# Altium schematic sheet Power.SchDoc
size 292 x 193 mm; Author: Power Lin; DocumentNumber: 4; SheetNumber: 4; SheetTotal: 4; Website: wiki-power.com
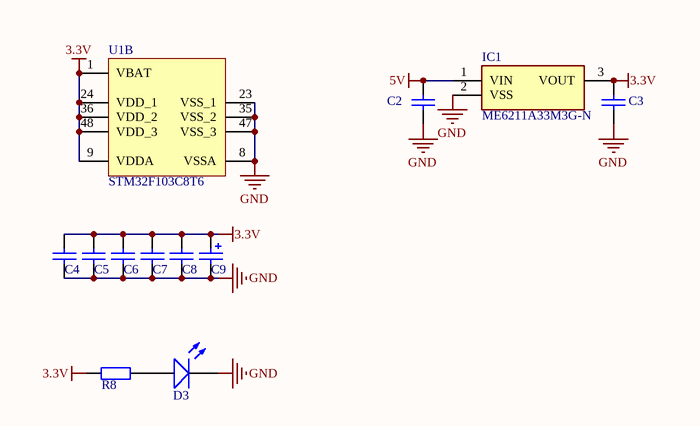
[diagram p0: Power.SchDoc]

## Parts
C2  1uF  [CAP-0603]  (value not drawn)
C3  1uF  [CAP-0603]  (value not drawn)
C4  100nF  [CAP-0603]  (value not drawn)
C5  100nF  [CAP-0603]  (value not drawn)
C6  100nF  [CAP-0603]  (value not drawn)
C7  100nF  [CAP-0603]  (value not drawn)
C8  100nF  [CAP-0603]  (value not drawn)
C9  10uF  [CASE-B_3528]  (value not drawn)
D3  RED  [LED-0603]  (value not drawn)
IC1  ME6211A33M3G-N  [SOT-23-3]
R8  10K  [R-0603]  (value not drawn)
U1  STM32F103C8T6  [LQFP_48]  (part B of 2)

## Nets
3.3V: C3.2 C4.2 C5.2 C6.2 C7.2 C8.2 C9.1 IC1.3(VOUT) R8.2 U1.1(VBAT) U1.9(VDDA) U1.24(VDD_1) U1.36(VDD_2) U1.48(VDD_3)
5V: C2.2 IC1.1(VIN)
GND: C2.1 C3.1 C4.1 C5.1 C6.1 C7.1 C8.1 C9.2 D3.K IC1.2(VSS) U1.8(VSSA) U1.23(VSS_1) U1.35(VSS_2) U1.47(VSS_3)
NetD3_A: D3.A R8.1

## Notes on the sheet
- Author
- DocumentName
- ModifiedDate
- ProjectName
- SheetNumber
- SheetTotal
- Website
- Revision

## Library data of the parts
C2-C8 = CAP: 贴片电容; ComponentLink1Description: 供应商链接; ComponentLink1URL: http://www.szlcsc.com/product/details_53938.html; Package: 0402; Supplier: LC; SuppliersPartNumber: C52923
C9 = CAP-POL: 贴片电容-有极性; ComponentLink1Description: 供应商链接; ComponentLink1URL: http://www.szlcsc.com/product/details_16815.html; Package: 3528; Supplier: LC; SuppliersPartNumber: C16133
D3 = LED: 发光二极管; pin to pad: A>1 K>2; ComponentLink1Description: 供应商链接; ComponentLink1URL: http://www.szlcsc.com/product/details_2663.html; Package: 0603; Supplier: LC; SuppliersPartNumber: C2290
IC1 = ME6211A33M3G-N: 线性稳压; Manufacturer_Name: Nexperia; Manufacturer_Part_Number: SI2302DS; Datasheet Link: https://assets.nexperia.com/documents/data-sheet/SI2302DS.pdf; Height: 1.1mm; Mouser Part Number: N/A; Mouser Price/Stock: https://www.mouser.com/Search/Refine.aspx?Keyword=N%2FA; RS Part Number: 7983053P; RS Price/Stock: http://uk.rs-online.com/web/p/products/7983053P
R8 = RES: 贴片电阻; Package: 0805; Supplier: LC; SuppliersPartNumber: C17798
U1 = STM32F103Cx: 单片机; PartNumber: STM32F100C8T6B; A/D Converter: 1x12-bit (10 Channel); Core: ARM Cortex-M3; D/A Converter: 2x12-bit (2 Channel); FLASH Size (Prog) (kB): 64; I/Os (High Current): 37; Internal RAM Size (kB): 8; Operating Frequency(F) (Processor speed) (MHz): 24; Packing: Tray; Supply Voltage(Vcc) min (V): 2; DatasheetVersion: Rev. 7; PackageVersion: Rev. 6, 06/2013; PackageReference: LQFP48; PackageDescription: 48-Pin Low Profile Quad Flat Package, 7 x 7 mm Body, 0.5 mm Pitch; Supplier 1: Digi-Key; Supplier Part Number 1: 497-10499-ND; Supplier 2: Farnell; Supplier Part Number 2: 1838511; Supplier 3: Newark; Supplier Part Number 3: 76R0988; Supplier 4: Mouser; Supplier Part Number 4: 511-STM32F100C8T6B; Mounting Technology: Surface Mount; ComponentLink1Description: Manufacturer URL; ComponentLink1URL: http://www.st.com/web/en/home.html; ComponentLink2Description: Datasheet; ComponentLink2URL: http://www.st.com/st-web-ui/static/active/en/resource/technical/document/datasheet/CD00251732.pdf; ComponentLink3Description: Package Specification; ComponentLink3URL: http://www.st.com/st-web-ui/static/active/en/resource/technical/document/datasheet/DM00058181.pdf